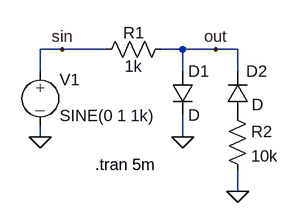
[diagram p0: schematic klirr_1.asc]
klirr_1.asc, the LTspice schematic file:
Version 4
SHEET 1 880 680
WIRE 96 80 64 80
WIRE 160 80 96 80
WIRE 272 80 240 80
WIRE 320 80 272 80
WIRE 352 80 320 80
WIRE 64 112 64 80
WIRE 272 112 272 80
WIRE 352 112 352 80
WIRE 64 208 64 192
WIRE 272 208 272 176
WIRE 352 288 352 256
FLAG 64 208 0
FLAG 96 80 sin
FLAG 272 208 0
FLAG 352 288 0
FLAG 320 80 out
SYMBOL source-V 64 96 R0
WINDOW 123 0 0 Left 2
WINDOW 39 0 0 Left 2
SYMATTR InstName V1
SYMATTR Value SINE(0 1 1k)
SYMBOL res 144 96 R270
WINDOW 0 25 56 VTop 2
WINDOW 3 7 56 VBottom 2
SYMATTR InstName R1
SYMATTR Value 1k
SYMBOL diode 256 112 R0
SYMATTR InstName D1
SYMBOL diode 368 176 R180
WINDOW 0 -27 64 Left 2
WINDOW 3 -22 15 Left 2
SYMATTR InstName D2
SYMBOL res 336 160 R0
SYMATTR InstName R2
SYMATTR Value 10k
TEXT 144 248 Left 2 !.tran 5m

The netlist it stands for:
* klirr_1.asc
V1 sin 0 SINE(0 1 1k)
R1 sin out 1k
D1 out 0 D
D2 P001 out D
R2 P001 0 10k
.model D D
.lib standard.dio
.tran 5m
.backanno
.end